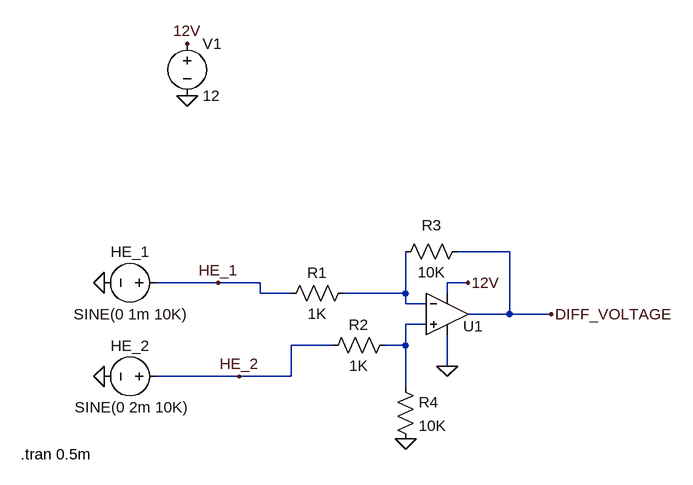
[diagram p0: schematic PEC_sensor.asc]
PEC_sensor.asc, the LTspice schematic file:
Version 4
SHEET 1 880 680
WIRE 448 256 368 256
WIRE 0 304 -96 304
WIRE 64 304 0 304
WIRE 384 304 352 304
WIRE 64 320 64 304
WIRE 112 320 64 320
WIRE 288 320 288 256
WIRE 288 320 192 320
WIRE 352 320 352 304
WIRE 288 336 288 320
WIRE 320 336 288 336
WIRE 448 352 448 256
WIRE 448 352 384 352
WIRE 512 352 448 352
WIRE 320 368 288 368
WIRE 176 400 112 400
WIRE 288 400 288 368
WIRE 288 400 256 400
WIRE 352 432 352 384
WIRE 32 448 -96 448
WIRE 112 448 112 400
WIRE 112 448 32 448
WIRE 288 464 288 400
FLAG -48 -64 12V
FLAG -48 16 0
FLAG 352 432 0
FLAG 384 304 12V
FLAG 288 544 0
FLAG 512 352 DIFF_VOLTAGE
FLAG -176 304 0
FLAG -176 448 0
FLAG 0 304 HE_1
FLAG 32 448 HE_2
SYMBOL OpAmps\\UniversalOpAmp 352 352 R0
WINDOW 0 25 19 Left 2
SYMATTR InstName U1
SYMBOL res 208 304 R90
WINDOW 0 0 56 VBottom 2
WINDOW 3 32 56 VTop 2
SYMATTR InstName R1
SYMATTR Value 1K
SYMATTR SpiceLine tol=1 pwr=0.1
SYMBOL res 272 448 R0
SYMATTR InstName R4
SYMATTR Value 10K
SYMATTR SpiceLine tol=1 pwr=0.1
SYMBOL voltage -48 -80 R0
WINDOW 123 0 0 Left 0
WINDOW 39 0 0 Left 0
SYMATTR InstName V1
SYMATTR Value 12
SYMBOL res 384 240 R90
WINDOW 0 -9 56 VBottom 2
WINDOW 3 32 56 VTop 2
SYMATTR InstName R3
SYMATTR Value 10K
SYMATTR SpiceLine tol=1 pwr=0.1
SYMBOL res 272 384 R90
WINDOW 0 0 56 VBottom 2
WINDOW 3 32 56 VTop 2
SYMATTR InstName R2
SYMATTR Value 1K
SYMATTR SpiceLine tol=1 pwr=0.1
SYMBOL voltage -80 304 R90
WINDOW 0 -32 56 VBottom 2
WINDOW 3 33 55 VTop 2
WINDOW 123 60 56 VTop 2
WINDOW 39 0 0 Left 0
SYMATTR InstName HE_1
SYMATTR Value SINE(0 1m 10K)
SYMBOL voltage -80 448 R90
WINDOW 0 -32 56 VBottom 2
WINDOW 3 32 53 VTop 2
WINDOW 123 60 56 VTop 2
WINDOW 39 0 0 Left 0
SYMATTR InstName HE_2
SYMATTR Value SINE(0 2m 10K)
TEXT -304 568 Left 2 !.tran 0.5m

The netlist it stands for:
* PEC_sensor.asc
XU1 N002 N001 12V 0 DIFF_VOLTAGE level1 Avol=1Meg GBW=10Meg Vos=0 En=0 Enk=0 In=0 Ink=0 Rin=500Meg  ; pins In+ In- V+ V- OUT
R1 N001 HE_1 1K tol=1 pwr=0.1
R4 N002 0 10K tol=1 pwr=0.1
V1 12V 0 12
R3 DIFF_VOLTAGE N001 10K tol=1 pwr=0.1
R2 N002 HE_2 1K tol=1 pwr=0.1
V§HE_1 HE_1 0 SINE(0 1m 10K)
V§HE_2 HE_2 0 SINE(0 2m 10K)
.tran 0.5m
.lib UniversalOpAmp1.lib
.backanno
.end